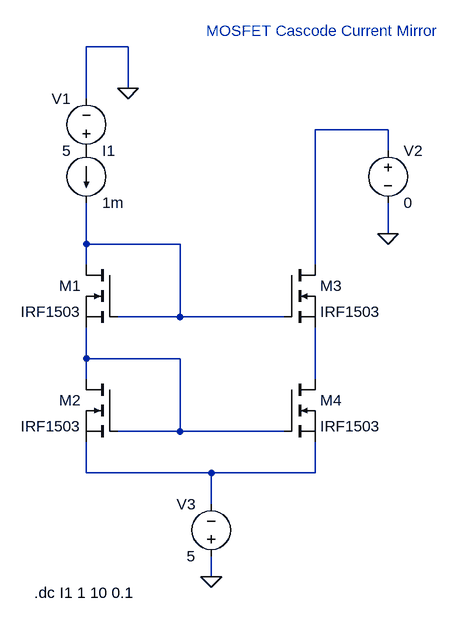
[diagram p0: schematic Draft2.asc]
Draft2.asc, the LTspice schematic file:
Version 4
SHEET 1 880 904
WIRE -96 48 -160 48
WIRE -96 112 -96 48
WIRE -160 128 -160 48
WIRE 304 176 192 176
WIRE 304 208 304 176
WIRE 304 336 304 288
WIRE -160 352 -160 288
WIRE -16 352 -160 352
WIRE -160 384 -160 352
WIRE 192 384 192 176
WIRE -16 464 -16 352
WIRE -16 464 -112 464
WIRE 144 464 -16 464
WIRE -160 528 -160 480
WIRE -16 528 -160 528
WIRE -160 560 -160 528
WIRE 192 560 192 480
WIRE -16 640 -16 528
WIRE -16 640 -112 640
WIRE 144 640 -16 640
WIRE -160 704 -160 656
WIRE 32 704 -160 704
WIRE 192 704 192 656
WIRE 192 704 32 704
WIRE 32 752 32 704
WIRE 32 864 32 832
FLAG -96 112 0
FLAG 304 336 0
FLAG 32 864 0
SYMBOL voltage -160 224 R180
WINDOW 0 24 96 Left 2
WINDOW 3 24 16 Left 2
WINDOW 123 0 0 Left 0
WINDOW 39 0 0 Left 0
SYMATTR InstName V1
SYMATTR Value 5
SYMBOL nmos -112 384 M0
SYMATTR InstName M1
SYMATTR Value IRF1503
SYMBOL nmos -112 560 M0
SYMATTR InstName M2
SYMATTR Value IRF1503
SYMBOL nmos 144 384 R0
SYMATTR InstName M3
SYMATTR Value IRF1503
SYMBOL nmos 144 560 R0
SYMATTR InstName M4
SYMATTR Value IRF1503
SYMBOL voltage 304 192 R0
WINDOW 123 0 0 Left 0
WINDOW 39 0 0 Left 0
SYMATTR InstName V2
SYMATTR Value 0
SYMBOL voltage 32 848 R180
WINDOW 0 24 96 Left 2
WINDOW 3 24 16 Left 2
WINDOW 123 0 0 Left 0
WINDOW 39 0 0 Left 0
SYMATTR InstName V3
SYMATTR Value 5
SYMBOL current -160 208 R0
WINDOW 123 0 0 Left 0
WINDOW 39 0 0 Left 0
SYMATTR InstName I1
SYMATTR Value 1m
TEXT 24 24 Left 2 ;MOSFET Cascode Current Mirror
TEXT -240 888 Left 2 !.dc I1 1 10 0.1

The netlist it stands for:
* Draft2.asc
V1 P001 0 5
M1 N002 N002 N003 N003 IRF1503
M2 N003 N003 N005 N005 IRF1503
M3 N001 N002 N004 N004 IRF1503
M4 N004 N003 N005 N005 IRF1503
V2 N001 0 0
V3 0 N005 5
I1 P001 N002 1m
.model NMOS NMOS
.model PMOS PMOS
.lib standard.mos
* MOSFET Cascode Current Mirror
.dc I1 1 10 0.1
.backanno
.end